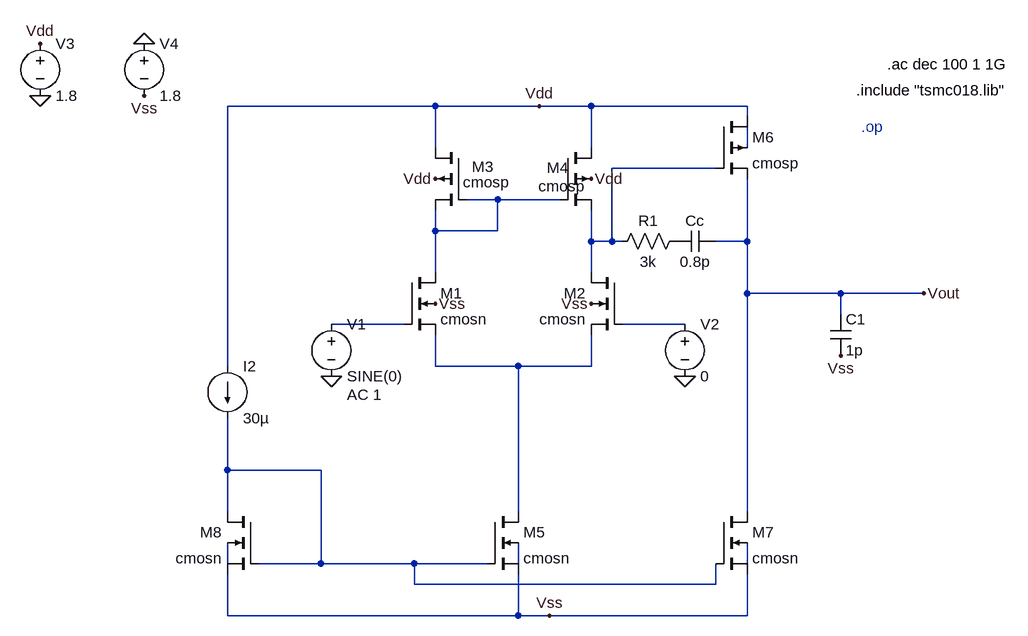
[diagram p0: schematic two_stage_ota_MEETSPECS.asc]
two_stage_ota_MEETSPECS.asc, the LTspice schematic file:
Version 4.1
SHEET 1 1300 956
WIRE 48 128 -272 128
WIRE 208 128 48 128
WIRE 288 128 208 128
WIRE 528 128 288 128
WIRE 528 144 528 128
WIRE 48 192 48 128
WIRE 288 192 288 128
WIRE 528 192 528 160
WIRE 480 224 320 224
WIRE 144 272 96 272
WIRE 240 272 144 272
WIRE 48 320 48 288
WIRE 144 320 144 272
WIRE 144 320 48 320
WIRE 288 336 288 288
WIRE 320 336 320 224
WIRE 320 336 288 336
WIRE 336 336 320 336
WIRE 528 336 528 240
WIRE 528 336 480 336
WIRE 48 384 48 320
WIRE 288 384 288 336
WIRE 528 416 528 336
WIRE 672 416 528 416
WIRE 800 416 672 416
WIRE 672 448 672 416
WIRE 0 464 -112 464
WIRE 432 464 336 464
WIRE -272 528 -272 128
WIRE 48 528 48 480
WIRE 176 528 48 528
WIRE 288 528 288 480
WIRE 288 528 176 528
WIRE -272 688 -272 608
WIRE -128 688 -272 688
WIRE -272 752 -272 688
WIRE 176 752 176 528
WIRE 528 752 528 416
WIRE -272 832 -272 800
WIRE -128 832 -128 688
WIRE -128 832 -224 832
WIRE 16 832 -128 832
WIRE 128 832 16 832
WIRE 176 832 176 800
WIRE 528 832 528 800
WIRE 16 864 16 832
WIRE 480 864 480 832
WIRE 480 864 16 864
WIRE -272 912 -272 848
WIRE 176 912 176 848
WIRE 176 912 -272 912
WIRE 224 912 176 912
WIRE 528 912 528 848
WIRE 528 912 224 912
FLAG -112 544 0
FLAG 432 544 0
FLAG -560 112 0
FLAG -560 32 Vdd
FLAG 48 240 Vdd
FLAG 288 240 Vdd
FLAG 208 128 Vdd
FLAG 800 416 Vout
FLAG -400 32 0
FLAG -400 112 Vss
FLAG 288 432 Vss
FLAG 48 432 Vss
FLAG 224 912 Vss
FLAG 672 512 Vss
SYMBOL nmos4 336 384 M0
SYMATTR InstName M2
SYMATTR Value cmosn
SYMATTR Value2 l=1u w=21.4u m=1
SYMBOL nmos4 0 384 R0
SYMATTR InstName M1
SYMATTR Value cmosn
SYMATTR Value2 l=1u w=21.4u
SYMBOL voltage -112 448 R0
WINDOW 123 24 124 Left 2
WINDOW 39 0 0 Left 0
SYMATTR Value2 AC 1
SYMATTR InstName V1
SYMATTR Value SINE(0)
SYMBOL voltage 432 448 R0
WINDOW 123 0 0 Left 0
WINDOW 39 0 0 Left 0
SYMATTR InstName V2
SYMATTR Value 0
SYMBOL voltage -560 16 R0
WINDOW 123 0 0 Left 0
WINDOW 39 0 0 Left 0
SYMATTR InstName V3
SYMATTR Value 1.8
SYMBOL pmos4 240 192 R0
WINDOW 0 -20 31 Left 2
WINDOW 3 -33 59 Left 2
SYMATTR InstName M4
SYMATTR Value cmosp
SYMATTR Value2 l=1u w=6.66u
SYMBOL pmos4 96 192 M0
WINDOW 0 -42 29 Left 2
WINDOW 3 -66 53 Left 2
SYMATTR InstName M3
SYMATTR Value cmosp
SYMATTR Value2 l=1u w=6.66u
SYMBOL pmos4 480 144 R0
SYMATTR InstName M6
SYMATTR Value cmosp
SYMATTR Value2 l=1u w=40.4u m=1
SYMBOL nmos4 480 752 R0
SYMATTR InstName M7
SYMATTR Value cmosn
SYMATTR Value2 l=1u w=5u
SYMBOL nmos4 128 752 R0
SYMATTR InstName M5
SYMATTR Value cmosn
SYMATTR Value2 l=500n w=640n
SYMBOL nmos4 -224 752 M0
SYMATTR InstName M8
SYMATTR Value cmosn
SYMATTR Value2 l=500n w=640n
SYMBOL current -272 528 R0
WINDOW 123 0 0 Left 0
WINDOW 39 0 0 Left 0
SYMATTR InstName I2
SYMATTR Value 30µ
SYMBOL voltage -400 16 R0
WINDOW 123 0 0 Left 0
WINDOW 39 0 0 Left 0
SYMATTR InstName V4
SYMATTR Value 1.8
SYMBOL cap 656 448 R0
SYMATTR InstName C1
SYMATTR Value 1p
SYMBOL cap 480 320 R90
WINDOW 0 0 32 VBottom 2
WINDOW 3 32 32 VTop 2
SYMATTR InstName Cc
SYMATTR Value 0.8p
SYMBOL res 432 320 R90
WINDOW 0 0 56 VBottom 2
WINDOW 3 32 56 VTop 2
SYMATTR InstName R1
SYMATTR Value 3k
TEXT 696 104 Left 2 !.include "tsmc018.lib"
TEXT 744 64 Left 2 !.ac dec 100 1 1G
TEXT 704 160 Left 2 ;.op

The netlist it stands for:
* two_stage_ota_MEETSPECS.asc
M2 N002 N005 N006 Vss cmosn l=1u w=21.4u m=1
M1 N003 N004 N006 Vss cmosn l=1u w=21.4u
V1 N004 0 SINE(0) AC 1
V2 N005 0 0
V3 Vdd 0 1.8
M4 Vdd N003 N002 Vdd cmosp l=1u w=6.66u
M3 Vdd N003 N003 Vdd cmosp l=1u w=6.66u
M6 Vdd N002 Vout N001 cmosp l=1u w=40.4u m=1
M7 Vout N007 Vss N010 cmosn l=1u w=5u
M5 N006 N007 Vss N009 cmosn l=500n w=640n
M8 N007 N007 Vss N008 cmosn l=500n w=640n
I2 Vdd N007 30µ
V4 0 Vss 1.8
C1 Vout Vss 1p
Cc Vout P001 0.8p
R1 P001 N002 3k
.model NMOS NMOS
.model PMOS PMOS
.lib standard.mos
.include "tsmc018.lib"
.ac dec 100 1 1G
* .op
.backanno
.end